# Altium project AutonomousVehicle_MotorDriver.PrjPcb
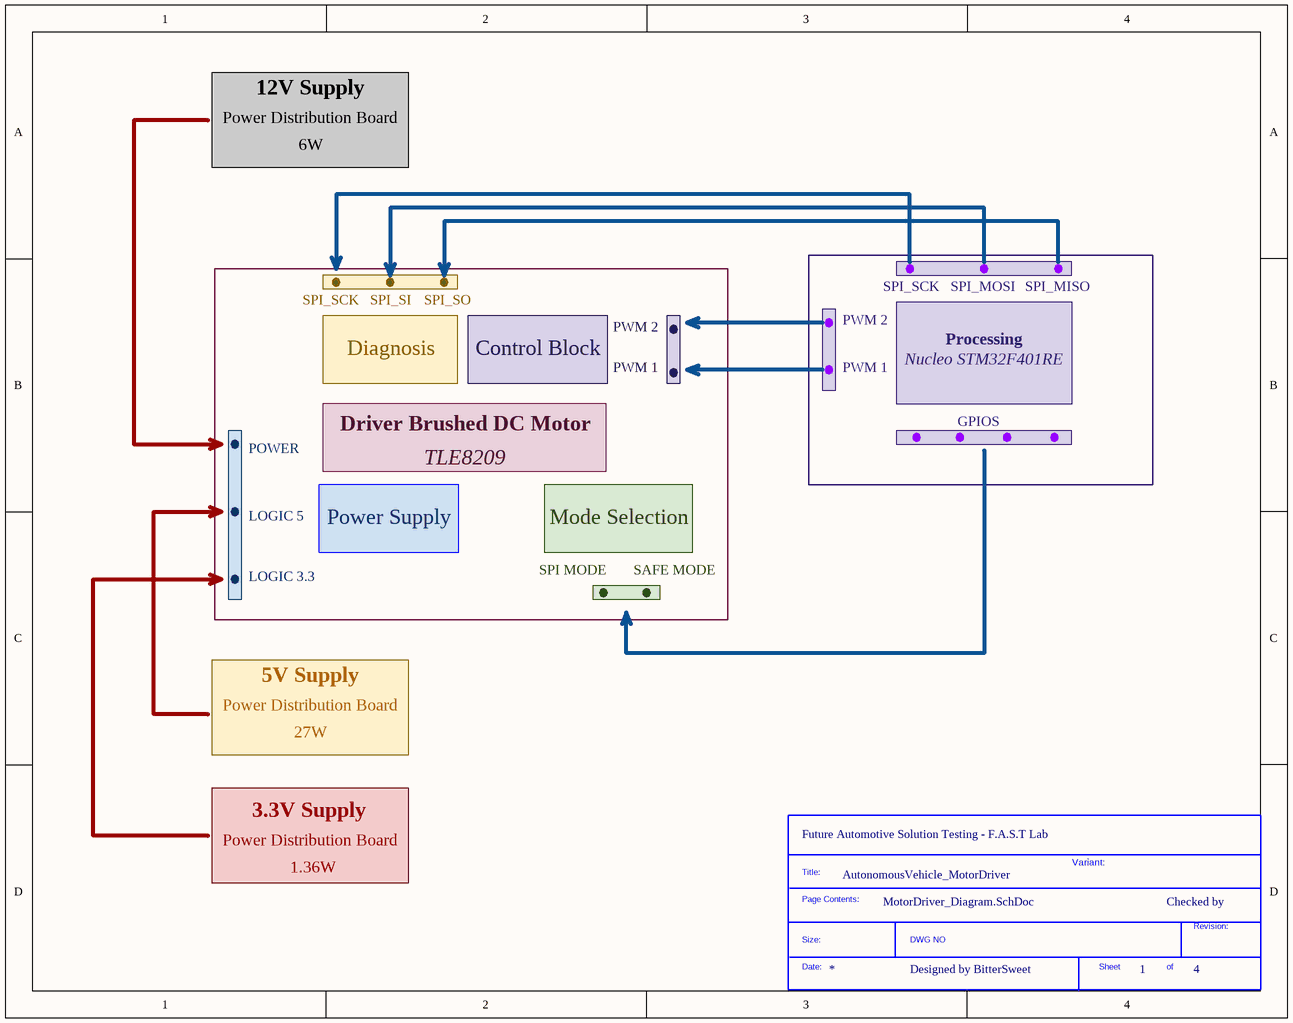
[diagram p0: MotorDriver_Diagram.SchDoc]
4 sheets, 52 parts. Net scope: flat (ports and power ports of the same name join across sheets).
Board file: AutonomousVehicle_MotorDriver.PcbDoc
Sheets:
  MotorDriver_Diagram.SchDoc
  MotorDriver_FileInfo.SchDoc
  MotorDriver_BrushedMotor_IO.SchDoc
  MotorDriver_BrushedMotor_Communication.SchDoc

## Sheet MotorDriver_Diagram.SchDoc
size A; SheetNumber: 1; SheetTotal: 4

### Parts
(Parts that share a designator on the sheet are numbered #1, #2 ... from top to bottom, then left to right.)
*?#1  SDTitleBlock  (value not drawn)  (graphical)

### Notes on the sheet
- 12V Supply
- Power Distribution Board
- 6W
- SPI_SCK
- SPI_MOSI
- SPI_MISO
- Diagnosis
- SPI_SI
- SPI_SO
- Control Block
- PWM 1
- PWM 2
- Nucleo STM32F401RE
- Processing
- Driver Brushed DC Motor
- GPIOS
- POWER
- TLE8209
- LOGIC 5
- Power Supply
- Mode Selection
- LOGIC 3.3
- SPI MODE
- SAFE MODE
- 5V Supply
- 27W
- 3.3V Supply
- (near *?#1) Future Automotive Solution Testing - F.A.S.T Lab
- 1.36W
- AutonomousVehicle_MotorDriver
- Variant:
- Checked by
- Designed by BitterSweet
- (in symbol SDTitleBlock) Title:; Page Contents:; Revision:; Size:; DWG NO; Date:; Sheet; of

## Sheet MotorDriver_FileInfo.SchDoc
size A; SheetNumber: 2; SheetTotal: 4
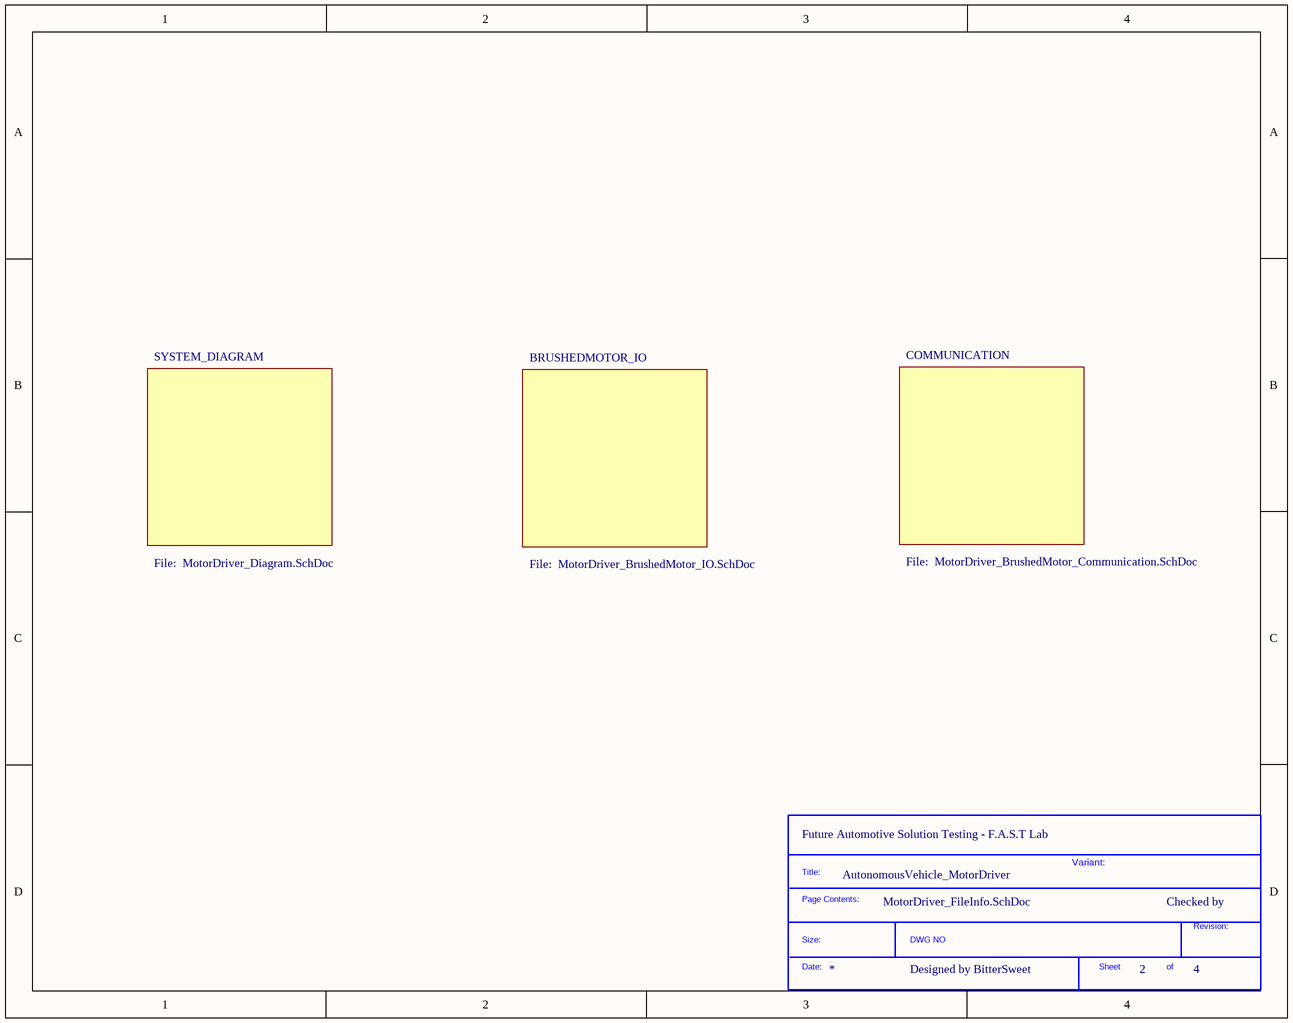
[diagram p1: MotorDriver_FileInfo.SchDoc]

### Parts
(Parts that share a designator on the sheet are numbered #1, #2 ... from top to bottom, then left to right.)
*?#2  SDTitleBlock  (value not drawn)  (graphical)

### Notes on the sheet
- SYSTEM_DIAGRAM
- BRUSHEDMOTOR_IO
- COMMUNICATION
- File:  MotorDriver_Diagram.SchDoc
- File:  MotorDriver_BrushedMotor_IO.SchDoc
- File:  MotorDriver_BrushedMotor_Communication.SchDoc
- (near *?#2) Future Automotive Solution Testing - F.A.S.T Lab
- AutonomousVehicle_MotorDriver
- Variant:
- Checked by
- Designed by BitterSweet
- (in symbol SDTitleBlock) Title:; Page Contents:; Revision:; Size:; DWG NO; Date:; Sheet; of

## Sheet MotorDriver_BrushedMotor_IO.SchDoc
size A; SheetNumber: 3; SheetTotal: 4
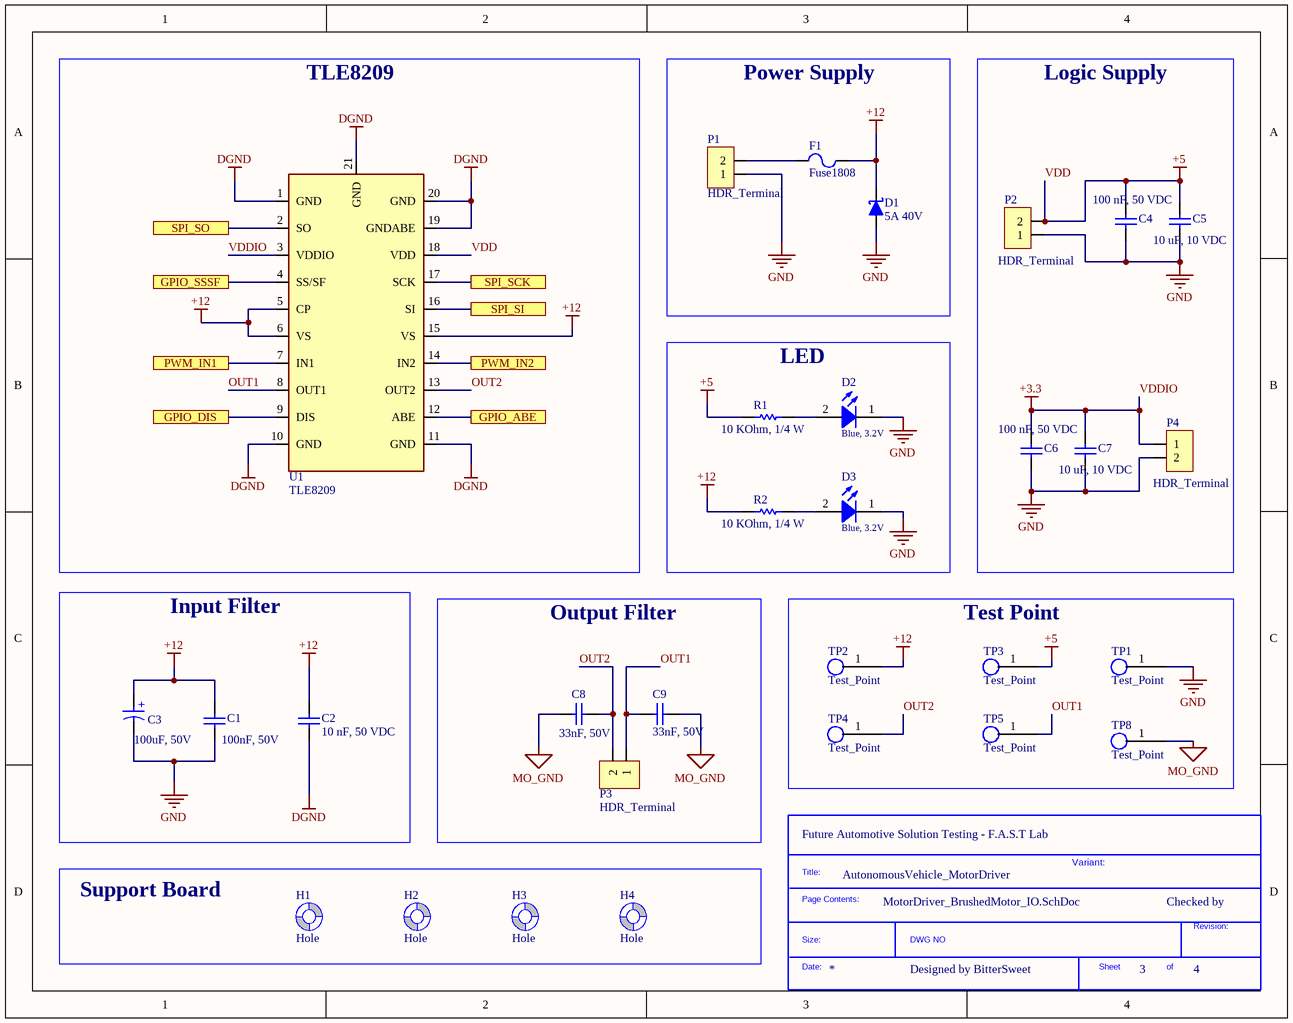
[diagram p2: MotorDriver_BrushedMotor_IO.SchDoc]

### Parts
(Parts that share a designator on the sheet are numbered #1, #2 ... from top to bottom, then left to right.)
*?#3  SDTitleBlock  (value not drawn)  (graphical)
C1  100nF, 50V  [CAP_RADIAL_2.54]
C2  10 nF, 50 VDC  [CAP_0805]
C3  100uF, 50V  [WCAP-ASLI_D8H10.5]
C4  100 nF, 50 VDC  [CAP_0603]
C5  10 uF, 10 VDC  [CAP_0603]
C6  100 nF, 50 VDC  [CAP_0603]
C7  10 uF, 10 VDC  [CAP_0603]
C8  33nF, 50V  [CAP_RADIAL_2.54]
C9  33nF, 50V  [CAP_RADIAL_2.54]
D1  5A 40V  [DO-214AB, SMC]
D2  Blue, 3.2V  [WL-SMCW_0603_H=0.7mm]
D3  Blue, 3.2V  [WL-SMCW_0603_H=0.7mm]
F1  Fuse1808  [FuseHolder1808]
H1  Hole  [Hole_3.2mm]
H2  Hole  [Hole_3.2mm]
H3  Hole  [Hole_3.2mm]
H4  Hole  [Hole_3.2mm]
P1  HDR_Terminal  [KF-5.08-2-R]
P2  HDR_Terminal  [HDR_HEADER_2.0_HORIZONTAL]
P3  HDR_Terminal  [KF-5.08-2-R]
P4  HDR_Terminal  [HDR_HEADER_2.0_HORIZONTAL]
R1  10 KOhm, 1/4 W  [resistor_0603]
R2  10 KOhm, 1/4 W  [resistor_0603]
TP1  Test_Point  [TP_1_5mm_SMD]
TP2  Test_Point  [TP_1_5mm_SMD]
TP3  Test_Point  [TP_1_5mm_SMD]
TP4  Test_Point  [TP_1_5mm_SMD]
TP5  Test_Point  [TP_1_5mm_SMD]
TP8  Test_Point  [TP_1_5mm_SMD]
U1  TLE8209  [TLE8209_2E_PG-DSO-20-71]

### Blocks framed on the sheet
TLE8209: U1
Power Supply: D1 F1 P1
Logic Supply: C4-C7 P2 P4
LED: D2 D3 R1 R2
Input Filter: C1-C3
Output Filter: C8 C9 P3
Test Point: TP1-TP5 TP8
Support Board: H1-H4

### Ports
GPIO_ABE, GPIO_DIS, GPIO_SSSF, PWM_IN1, PWM_IN2, SPI_SCK, SPI_SI, SPI_SO

### Nets
+12: C1.2 C2.2 C3.1(P) D1.2(K) F1.2 R2.2 TP2.1 U1.5(CP) U1.6(VS) U1.15(VS)
DGND: C2.1 U1.1(GND) U1.10(GND) U1.11(GND) U1.19(GNDABE) U1.20(GND) U1.21(GND)
GND: C1.1 C3.2(N) C4.1 C5.1 C6.1 C7.1 D1.1(A) D2.1(K) D3.1(K) P1.1 P2.1 P4.2 TP1.1
MO_GND: C8.2 C9.2 TP8.1
VDD: C4.2 C5.2 P2.2 R1.2 TP3.1 U1.18(VDD)  [also labelled +5]
VDDIO: C6.2 C7.2 P4.1 U1.3(VDDIO)  [also labelled +3.3]
OUT1: C9.1 P3.1 TP5.1 U1.8(OUT1)
OUT2: C8.1 P3.2 TP4.1 U1.13(OUT2)
NetD2_2: D2.2(A) R1.1
NetD3_2: D3.2(A) R2.1
NetF1_1: F1.1 P1.2
NetP5_2: U1.4(SS/SF) ; port GPIO_SSSF
NetP5_3: U1.9(DIS) ; port GPIO_DIS
NetP6_1: U1.16(SI) ; port SPI_SI
NetP6_2: U1.17(SCK) ; port SPI_SCK
NetP6_3: U1.2(SO) ; port SPI_SO
NetQ1_3: U1.7(IN1) ; port PWM_IN1
NetQ2_3: U1.14(IN2) ; port PWM_IN2
NetQ3_1: U1.12(ABE) ; port GPIO_ABE

Not connected (* = marked no-connect by the designer): H1 1(Screw); H2 1(Screw); H3 1(Screw); H4 1(Screw)

### Notes on the sheet
- (near *?#3) Future Automotive Solution Testing - F.A.S.T Lab
- AutonomousVehicle_MotorDriver
- Variant:
- Checked by
- Designed by BitterSweet
- (in symbol 865080653016) +
- (in symbol SDTitleBlock) Title:; Page Contents:; Revision:; Size:; DWG NO; Date:; Sheet; of

### Library data of the parts
C1 C8 C9 = Capacitor: JLCPCB Part: *
  C1: URL: https://www.thegioiic.com/product/tu-gom-xuyen-lo?prid=6863
  C8: URL: https://www.thegioiic.com/product/tu-gom-xuyen-lo?prid=6856
  C9: URL: https://www.thegioiic.com/product/tu-gom-xuyen-lo?prid=6856; ComponentLink1Description: JLCPCB Link; ComponentLink1URL: *
C2 = 0108051031050: CAP, size 0805, 10 nF, 50 VDC; Manufacture Name: TDK; Manufacture SN: CGA4C2C0G1H103J060AA; Capacitance: 10 nF; Tolerance: +/-5%; Voltage Rating DC: 50 VDC; ComponentLink2Description: Datasheet; ComponentLink2URL: https://product.tdk.com/system/files/dam/doc/product/capacitor/ceramic/mlcc/catalog/mlcc_automotive_general_en.pdf?ref_disty=mouser; Operating Temperature: -55 to +125degC; Packaging: Tape and Reel; Mounting Technology: SMT; Size: 0805; Supplier 1 Name: Mouser; Supplier 1 SN: 810-CGA4C2C0G1H103J; Supplier 1 URL: https://www.mouser.vn/ProductDetail/TDK/CGA4C2C0G1H103J060AA?qs=FxQuwy19cyC9M6v0nMqjhA%3D%3D&utm_source=mouser-refine-download&utm_medium=file&utm_campaign=CGA4C2C0G1H103J060AA&utm_content=TDK; Supplier 2 Name: Digi-Key; Supplier 2 SN: 445-6947-2-ND; Supplier 2 URL: https://www.digikey.com/en/products/detail/tdk-corporation/cga4c2c0g1h103j060aa/2672840; Supplier 3 Name: thegioiic; Supplier 3 SN: OEM; Supplier 3 URL: N/A; Value: 10 nF, 50 VDC; JLCPCB Part: *
C3 = 865080653016: V-Chip, D8 x H10.5mm, 100uF, 50V; Manufacturer: Wurth Elektronik; Capacitance Tolerance: +/-20%; Dissipation Factor: 12%; Endurance: 2000h; Leakage Current: 50uA; Ripple Current: 350mA; Category: Aluminum Electrolytic Capacitors; ComponentLink2Description: Datasheet Link; ComponentLink2URL: https://www.we-online.com/redexpert/spec/865080653016?ad; Mount: Surface Mount; Operating Temperature Max: 105°C; Operating Temperature Min: -55°C; Packaging: Tape and Reel; Height: 10.5mm; Diameter: 8mm; Capacitance: 100uF; Rated Voltage (DC): 50V; Supplier 1 Name: Mouser; Supplier 1 SN: 710-865080653016; Supplier 1 URL: https://www.mouser.vn/ProductDetail/Wurth-Elektronik/865080653016?qs=0KOYDY2FL2%2FUDYNkMs7i0Q%3D%3D; Supplier 3 Name: thegioiic; Supplier 3 URL: https://www.thegioiic.com/tu-nhom-smd-100uf-50v-8x10-5mm; Manufacturer Part Number: N/A; Supplier 2 Name: Digi-Key; Supplier 2 SN: N/A; Supplier 2 URL: N/A; Supplier 3 SN: N/A; Value: 100uF, 50V; JLCPCB Part: *
C4 C6 = 0106031041050: CAP, size 0603, 100 nF, 50 VDC; Manufacture Name: TDK; Manufacture SN: CGA3E3X8R1H104K080AE; Capacitance: 100 nF; Tolerance: +/-10%; Voltage Rating DC: 50 VDC; ComponentLink2Description: Datasheet; ComponentLink2URL: https://product.tdk.com/system/files/dam/doc/product/capacitor/ceramic/mlcc/catalog/mlcc_automotive_soft_en.pdf?ref_disty=mouser; Operating Temperature: -55 to +125degC; Packaging: Tape and Reel; Mounting Technology: SMT; Size: 0603; Supplier 1 Name: Mouser; Supplier 1 SN: 810-CGA3E3X8R1H104KA; Supplier 1 URL: https://www.mouser.com/ProductDetail/TDK/CGA3E3X8R1H104K080AE?qs=nQSIdc08i%252Bd8g3IRRgU2bw%3D%3D&utm_source=mouser-refine-download&utm_medium=file&utm_campaign=CGA3E3X8R1H104K080AE&utm_content=TDK; Supplier 2 Name: Digi-Key; Supplier 2 SN: 445-173697-2-ND; Supplier 2 URL: https://www.digikey.com/en/products/detail/tdk-corporation/cga3e3x8r1h104k080ae/5809262; Supplier 3 Name: thegioiic; Supplier 3 SN: N/A; Supplier 3 URL: N/A; Value: 100 nF, 50 VDC; JLCPCB Part: C1591; ComponentLink3Description: JLCPCB Link; ComponentLink3URL: https://jlcpcb.com/partdetail/1943-CL10B104KB8NNNC/C1591
C5 C7 = 0106031061010: CAP, size 0603, 10 uF, 10 VDC; Manufacture Name: Samsung Electro-Mechanics; Manufacture SN: CL10A106KP8NNWC; Capacitance: 10 uF; Tolerance: +/-10%; Voltage Rating DC: 10 VDC; ComponentLink2Description: Datasheet; ComponentLink2URL: https://www.mouser.vn/datasheet/2/585/MLCC-1837944.pdf; Operating Temperature: -55 to +125degC; Packaging: Tape and Reel; Mounting Technology: SMT; Size: 0603; Supplier 1 Name: Mouser; Supplier 1 SN: 187-CL10A106KP8NNWC; Supplier 1 URL: https://www.mouser.vn/ProductDetail/Samsung-Electro-Mechanics/CL10A106KP8NNWC?qs=xZ%2FP%252Ba9zWqZx8LSX23YqWA%3D%3D&utm_source=mouser-refine-download&utm_medium=file&utm_campaign=CL10A106KP8NNWC&utm_content=Samsung-Electro-Mechanics; Supplier 2 Name: Digi-Key; Supplier 2 SN: 1276-CL10A106KP8NNWCTR-ND; Supplier 2 URL: https://www.digikey.com/en/products/detail/samsung-electro-mechanics/cl10a106kp8nnwc/16572907; Supplier 3 Name: thegioiic; Supplier 3 SN: N/A; Supplier 3 URL: https://www.thegioiic.com/tu-gom-0603-10uf-25v; Value: 10 uF, 10 VDC; JLCPCB Part: C91150; ComponentLink3Description: JLCPCB Link; ComponentLink3URL: https://jlcpcb.com/partdetail/92339-0603X106M100NT/C91150
D1 = Diode_Schottky: SS54 SMC Diode Schottky 5A 40V; JLCPCB Part: C2904822; ComponentLink1Description: JLCPCB Link; ComponentLink1URL: https://jlcpcb.com/partdetail/YONGYUTAI-SS54/C2904822
D2 D3 = 160603BlueClear: WL-SMCW SMT Mono-color Chip LED Waterclear, size 0603, Blue, 3.2V, 140deg; Type: Clear; Color: Blue; Size: 0603; ComponentLink1URL: N/A; ComponentLink2Description: Supplier 1 URL; ComponentLink2URL: https://www.mouser.vn/ProductDetail/Wurth-Elektronik/150060BS75003?qs=Li%252BoUPsLEnu8LvIbM48DKA%3D%3D; ComponentLink3Description: Supplier 2 URL; ComponentLink3URL: https://www.digikey.com/en/products/detail/liteon/LTST-C191TBKT/388530; ComponentLink4Description: Supplier 3 URL; ComponentLink4URL: https://www.thegioiic.com/led-xanh-duong-0603-dan-smd-trong-suot; Supplier 1 Name: Mouser; Supplier 1 SN: 710-150060GS75000; Supplier 1 URL: https://www.mouser.vn/ProductDetail/Wurth-Elektronik/150060BS75003?qs=Li%252BoUPsLEnu8LvIbM48DKA%3D%3D; Supplier 2 Name: Digi-Key; Supplier 2 SN: 160-1647-2-ND; Supplier 2 URL: https://www.digikey.com/en/products/detail/liteon/LTST-C191TBKT/388530; Supplier 3 Name: ICDayRoi; Supplier 3 SN: N/A; Supplier 3 URL: https://www.thegioiic.com/led-xanh-duong-0603-dan-smd-trong-suot; Value: Blue, 3.2V; JLCPCB Part: *; Parameter 1: *
  D2: ComponentLink1Description: Datasheet link
  D3: ComponentLink1Description: JLCPCB Link
F1 = Fuse1808: Fuse 1808 Holder SMD fast blow L9.73xW5.03xH3.81; JLCPCB Part: C206917; ComponentLink1Description: JLCPCB Link; ComponentLink1URL: https://jlcpcb.com/partdetail/Littelfuse-0154005DRT/C206917; ComponentLink2Description: Thegioiic Link; ComponentLink2URL: https://www.thegioiic.com/de-cau-chi-1808-dan-smd; ComponentLink3Description: Fuse Thegioiic Link; ComponentLink3URL: https://www.thegioiic.com/cau-chi-cat-nhanh-smd-1808-20a-250v
P1-P4 = HDR_Terminal: HDR_Terminal 2 pin; Supplier: ThegioiIC; ComponentLink1Description: URL; ComponentLink1URL: https://www.thegioiic.com/kf128-2-v-domino-2-chan-thang-3-5mm-300v-10a-han-pcb
R1 R2 = 0006031031: RES, size 0603, 10 KOhm, 1/4 W; Manufacture  Name: OEM; Resistance: 10 KOhm; Rated Power: 1/4 W; Resistance Tolerance: +/-1%; Size: 0603; Mounting Technology: SMT; Supplier 1 Name: Mouser; Supplier 1 SN: 755-ESR03EZPF1002; Supplier 2 Name: Digi-Key; Supplier 2 SN: RHM10KADTR-ND RHM10KADCT-ND RHM10KADDKR-ND; Supplier 1 URL: https://www.mouser.vn/ProductDetail/ROHM-Semiconductor/ESR03EZPF1002?qs=sGAEpiMZZMvdGkrng054t67Efho1F8r6CDeAsqwFse8%3D; Supplier 3 Name: thegioiic; Supplier 3 SN: N/A; Supplier 3 URL: N/A; Manufacture  SN: OEM; Value: 10 KOhm, 1/4 W; ComponentLink1Description: Datasheet link; ComponentLink1URL: https://fscdn.rohm.com/en/products/databook/datasheet/passive/resistor/chip_resistor/esr-e.pdf; ComponentLink2Description: Supplier 1 URL; ComponentLink2URL: https://www.thegioiic.com/dien-tro-10-kohm-0603-1-; ComponentLink3Description: Supplier 2 URL; ComponentLink3URL: https://www.digikey.com/en/products/detail/rohm-semiconductor/ESR03EZPF1002/1983429; ComponentLink4Description: Supplier 3 URL; ComponentLink4URL: N/A; Supplier 2 URL: https://www.digikey.com/en/products/detail/rohm-semiconductor/ESR03EZPF1002/1983429; JLCPCB Part: C2087321; Parameter 1: *; ComponentLink5Description: JLCPCB Link; ComponentLink5URL: https://jlcpcb.com/partdetail/Yageo-RT0603BRD1010KL/C2087321
U1 = TLE8209: SPI Programmable H-Bridge, Automotive Application for Motor Control, Throttle Control,...

## Sheet MotorDriver_BrushedMotor_Communication.SchDoc
size A; SheetNumber: 4; SheetTotal: 4
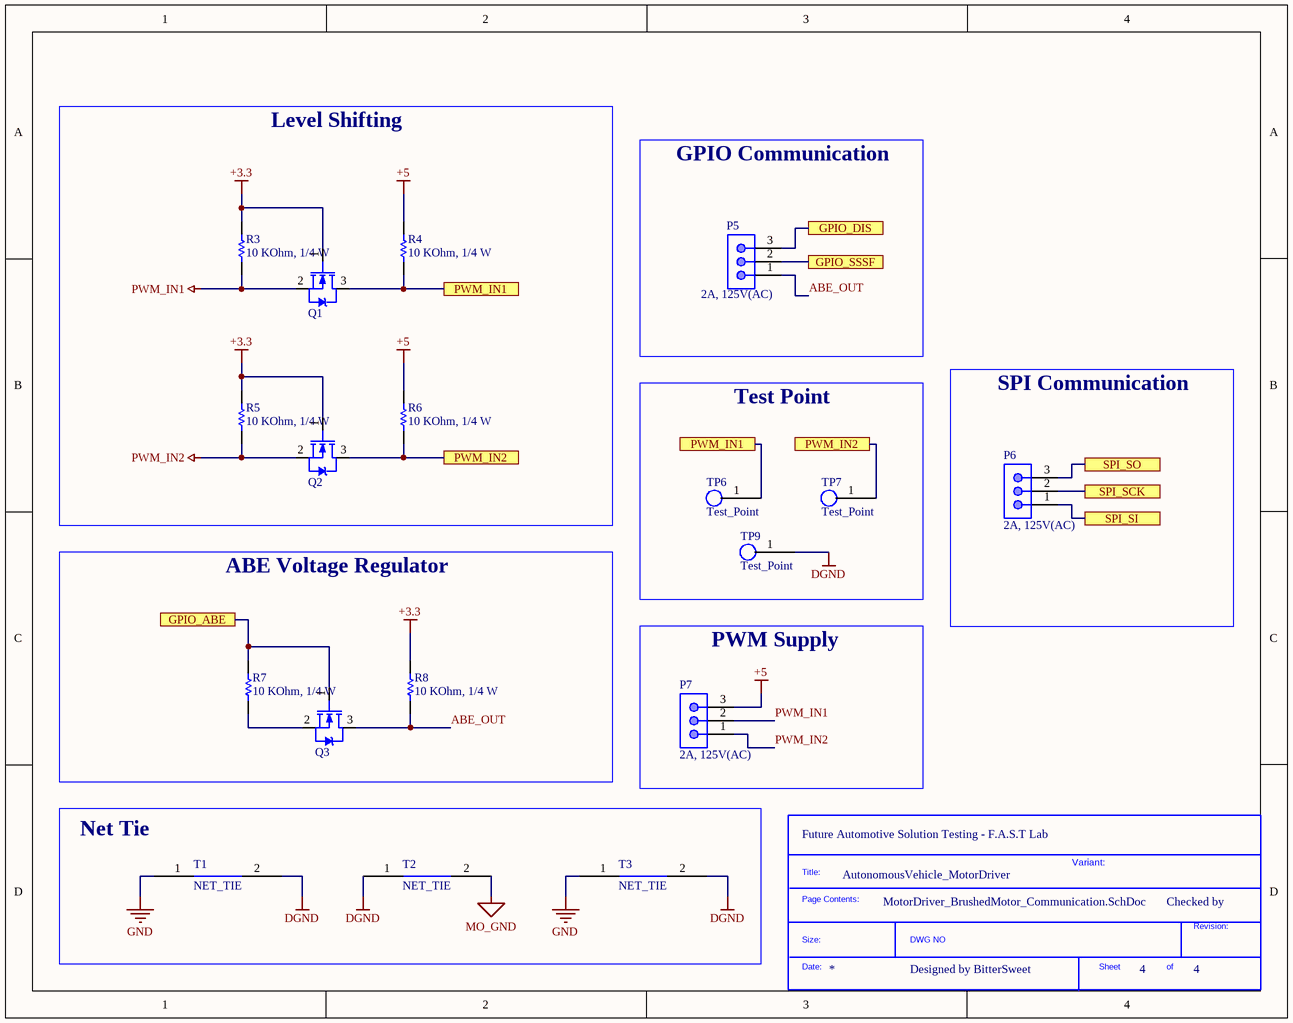
[diagram p3: MotorDriver_BrushedMotor_Communication.SchDoc]

### Parts
(Parts that share a designator on the sheet are numbered #1, #2 ... from top to bottom, then left to right.)
*?#4  SDTitleBlock  (value not drawn)  (graphical)
P5  2A, 125V(AC)  [620103131822]
P6  2A, 125V(AC)  [620103131822]
P7  2A, 125V(AC)  [620103131822]
Q1  Mosfet_N_channel  [MOSFET_N_SOT23-3]  (value not drawn)
Q2  Mosfet_N_channel  [MOSFET_N_SOT23-3]  (value not drawn)
Q3  Mosfet_N_channel  [MOSFET_N_SOT23-3]  (value not drawn)
R3  10 KOhm, 1/4 W  [resistor_0603]
R4  10 KOhm, 1/4 W  [resistor_0603]
R5  10 KOhm, 1/4 W  [resistor_0603]
R6  10 KOhm, 1/4 W  [resistor_0603]
R7  10 KOhm, 1/4 W  [resistor_0603]
R8  10 KOhm, 1/4 W  [resistor_0603]
T1  NET_TIE  [NET_TIE_2.0mm]
T2  NET_TIE  [NET_TIE_2.0mm]
T3  NET_TIE  [NET_TIE_2.0mm]
TP6  Test_Point  [TP_1_5mm_SMD]
TP7  Test_Point  [TP_1_5mm_SMD]
TP9  Test_Point  [TP_1_5mm_SMD]

### Blocks framed on the sheet
Level Shifting: Q1 Q2 R3-R6
GPIO Communication: P5
Test Point: TP6 TP7 TP9
SPI Communication: P6
ABE Voltage Regulator: Q3 R7 R8
PWM Supply: P7
Net Tie: T1-T3

### Ports
GPIO_ABE, GPIO_DIS, GPIO_SSSF, PWM_IN1, PWM_IN2, SPI_SCK, SPI_SI, SPI_SO

### Nets
+3.3: Q1.1(G) Q2.1(G) R3.1 R5.1 R8.1  [project net VDDIO]
+5: P7.3 R4.1 R6.1  [project net VDD]
DGND: T1.2 T2.1 T3.2 TP9.1
GND: T1.1 T3.1
MO_GND: T2.2
PWM_IN1: P7.2 Q1.2(S) R3.2
PWM_IN2: P7.1 Q2.2(S) R5.2
ABE_OUT: P5.1 Q3.3(D) R8.2
NetP5_2: P5.2 ; port GPIO_SSSF
NetP5_3: P5.3 ; port GPIO_DIS
NetP6_1: P6.1 ; port SPI_SI
NetP6_2: P6.2 ; port SPI_SCK
NetP6_3: P6.3 ; port SPI_SO
NetQ1_3: Q1.3(D) R4.2 TP6.1 ; port PWM_IN1
NetQ2_3: Q2.3(D) R6.2 TP7.1 ; port PWM_IN2
NetQ3_1: Q3.1(G) R7.1 ; port GPIO_ABE
NetQ3_2: Q3.2(S) R7.2

### Notes on the sheet
- (near *?#4) Future Automotive Solution Testing - F.A.S.T Lab
- AutonomousVehicle_MotorDriver
- Variant:
- Checked by
- Designed by BitterSweet
- (in symbol SDTitleBlock) Title:; Page Contents:; Revision:; Size:; DWG NO; Date:; Sheet; of

### Library data of the parts
P5-P7 = 620103131822: WR-WTB SMT Male Horizontal Shrouded Header, pitch 2mm, 3p; Pin Number: 3; Contact Resistance: 20mOhm; Withstanding Voltage: 800VAC; Working Voltage: 100VAC; ComponentLink1Description: Manufacturer; ComponentLink1URL: http://www.we-online.de; ComponentLink2Description: Datasheet; ComponentLink2URL: https://www.we-online.com/catalog/datasheet/620103131822.pdf; Pitch: 2mm; Published Date: January 2020; Publisher: Wurth Elektronik; Mounting Technology: SMT; Packaging: Tape and Reel; Operating Temperature: -25 to +85degC; Part Number: 620103131822; Gender: Male; Type: Horizontal; Rated Current: 2A; ComponentLink3Description: Global Supply; ComponentLink3URL: https://www.we-online.com/en/components/products/WTB_2_00_SMT_MALE_HORIZONTAL_SHROUDED_HEADER_6201XX131822?sq=620103131822#620103131822; ComponentLink4Description: Global Supply; ComponentLink4URL: https://www.mouser.vn/ProductDetail/Wurth-Elektronik/620103131822?qs=ZtY9WdtwX54jBicvPVEzcw%3D%3D; Supplier 1 Name: Mouser; Supplier 1 SN: 710-620103131822; Supplier 1 URL: https://www.mouser.vn/ProductDetail/Wurth-Elektronik/620103131822?qs=ZtY9WdtwX54jBicvPVEzcw%3D%3D; Supplier 2 Name: Digi-Key; Supplier 2 SN: N/A; Supplier 2 URL: N/A; Supplier 3 Name: thegioiic; Supplier 3 SN: N/A; Supplier 3 URL: N/A; Value: 2A, 125V(AC)
R3-R8 = 0006031031: as R1 on sheet MotorDriver_BrushedMotor_IO; Size: 0603; Mounting Technology: SMT; Supplier 1 Name: Mouser; Supplier 1 SN: 755-ESR03EZPF1002; Supplier 2 Name: Digi-Key; Supplier 2 SN: RHM10KADTR-ND RHM10KADCT-ND RHM10KADDKR-ND; Supplier 1 URL: https://www.mouser.vn/ProductDetail/ROHM-Semiconductor/ESR03EZPF1002?qs=sGAEpiMZZMvdGkrng054t67Efho1F8r6CDeAsqwFse8%3D; Supplier 3 Name: thegioiic; Supplier 3 SN: N/A; Supplier 3 URL: N/A; Manufacture  SN: OEM; Value: 10 KOhm, 1/4 W; ComponentLink1Description: Datasheet link; ComponentLink1URL: https://fscdn.rohm.com/en/products/databook/datasheet/passive/resistor/chip_resistor/esr-e.pdf; ComponentLink2Description: Supplier 1 URL; ComponentLink2URL: https://www.thegioiic.com/dien-tro-10-kohm-0603-1-; ComponentLink3Description: Supplier 2 URL; ComponentLink3URL: https://www.digikey.com/en/products/detail/rohm-semiconductor/ESR03EZPF1002/1983429; ComponentLink4Description: Supplier 3 URL; ComponentLink4URL: N/A; Supplier 2 URL: https://www.digikey.com/en/products/detail/rohm-semiconductor/ESR03EZPF1002/1983429; JLCPCB Part: C2087321; Parameter 1: *; ComponentLink5Description: JLCPCB Link; ComponentLink5URL: https://jlcpcb.com/partdetail/Yageo-RT0603BRD1010KL/C2087321
T1-T3 = NET_TIE: Straight Net Tie
Q1-Q3 = Mosfet_N_channel: JLCPCB Part: C22367238; ComponentLink1Description: JLCPCB Link; ComponentLink1URL: https://jlcpcb.com/partdetail/HXYMOSFET-Si2300DS_T1_GE3HXY/C22367238

## Nets that join several sheets
DGND: MotorDriver_BrushedMotor_IO (7 pins), MotorDriver_BrushedMotor_Communication (T1.2 T2.1 T3.2 TP9.1)
GND: MotorDriver_BrushedMotor_IO (13 pins), MotorDriver_BrushedMotor_Communication (T1.1 T3.1)
MO_GND: MotorDriver_BrushedMotor_IO (C8.2 C9.2 TP8.1), MotorDriver_BrushedMotor_Communication (T2.2)
VDD: MotorDriver_BrushedMotor_IO (6 pins), MotorDriver_BrushedMotor_Communication (P7.3 R4.1 R6.1)
VDDIO: MotorDriver_BrushedMotor_IO (C6.2 C7.2 P4.1 U1.3), MotorDriver_BrushedMotor_Communication (5 pins)
NetP5_2: MotorDriver_BrushedMotor_IO (U1.4), MotorDriver_BrushedMotor_Communication (P5.2)
NetP5_3: MotorDriver_BrushedMotor_IO (U1.9), MotorDriver_BrushedMotor_Communication (P5.3)
NetP6_1: MotorDriver_BrushedMotor_IO (U1.16), MotorDriver_BrushedMotor_Communication (P6.1)
NetP6_2: MotorDriver_BrushedMotor_IO (U1.17), MotorDriver_BrushedMotor_Communication (P6.2)
NetP6_3: MotorDriver_BrushedMotor_IO (U1.2), MotorDriver_BrushedMotor_Communication (P6.3)
NetQ1_3: MotorDriver_BrushedMotor_IO (U1.7), MotorDriver_BrushedMotor_Communication (Q1.3 R4.2 TP6.1)
NetQ2_3: MotorDriver_BrushedMotor_IO (U1.14), MotorDriver_BrushedMotor_Communication (Q2.3 R6.2 TP7.1)
NetQ3_1: MotorDriver_BrushedMotor_IO (U1.12), MotorDriver_BrushedMotor_Communication (Q3.1 R7.1)